# Altium schematic sheet QSPI.SchDoc: Quad SPI Flash Memory (MICRON)
size A4; Date: 25-FEB-2015; Author: A.B; CompanyName: STMicroelectronics; Address1: 12, Rue Jules HOROWITZ; Address2: 38019 Grenoble; Address3: FRANCE; DocumentNumber: MB1191; Revision: B-02; SheetNumber: 7; SheetTotal: 14; Project: STM32F746G-DISCO
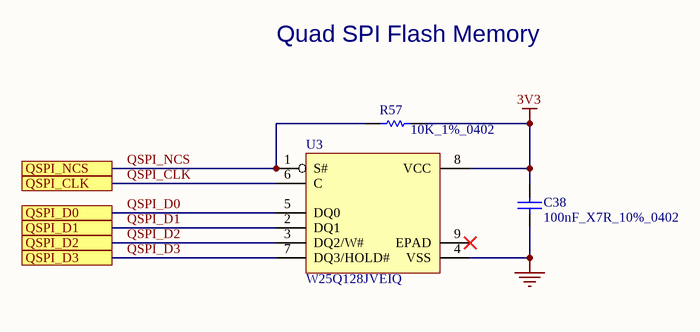
[diagram p0: QSPI.SchDoc]

## Parts
C38  100nF_X7R_10%_0402  [0402C]
R57  10K_1%_0402  [0402R]
U3  W25Q128JVEIQ  [W-PDFN-8_8X6_P127]

## Ports
QSPI_CLK, QSPI_D0, QSPI_D1, QSPI_D2, QSPI_D3, QSPI_NCS

## Nets
3V3: C38.2 R57.2 U3.8(VCC)
GND: C38.1 U3.4(VSS)
QSPI_CLK: U3.6(C) ; port QSPI_CLK
QSPI_D0: U3.5(DQ0) ; port QSPI_D0
QSPI_D1: U3.2(DQ1) ; port QSPI_D1
QSPI_D2: U3.3(DQ2/W#) ; port QSPI_D2
QSPI_D3: U3.7(DQ3/HOLD#) ; port QSPI_D3
QSPI_NCS: R57.1 U3.1(S#) ; port QSPI_NCS

Not connected (* = marked no-connect by the designer): U3 9(EPAD)*

## Notes on the sheet
- Quad SPI Flash Memory
- Title:
- Project:
- Size:
- Revision:
- Variant:
- A4
- -
- Date:
- Reference:
- Sheet:
- of

## Library data of the parts
C38 = Cap_100nF_X7R_10%_0402: Capacitor,100nF,16V,X7R,10%,0402,YAGEO; Manuf_Part_1: CC0402KRX7R7BB104; Revision: July-2002: Re-released for DXP Platform.; Value: 100nF; Order: CC0402KRX7R7BB104; Manuf_1: YAGEO; ECCN_US/EU: n/a
R57 = Res_10K_1%_0402: Resistor,10K,0402,1%,YAGEO; Manuf_Part_1: RC0402FR-0710KL; Value: 10K; Manuf_1: YAGEO; Order: RC0402FR-0710KL; ECCN_US/EU: n/a
U3 = MT25QL128ABA1EW9-0SIT: 128Mb, 3V, Multiple I/O Serial Flash Memory, Quad/Dual; Manuf_1: Winbond; ECCN_US/EU: 3A991/NEC; Provided: ST; Manuf_Part_1: W25Q128JVEIQ; Value: W25Q128JVEIQ